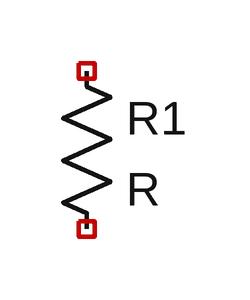
[diagram p0: schematic Draft2.asc]
Draft2.asc, the LTspice schematic file:
Version 4
SHEET 1 880 680
SYMBOL res 208 112 R0
SYMATTR InstName R1

The netlist it stands for:
* Draft2.asc
R1 NC_01 NC_02 R
.backanno
.end